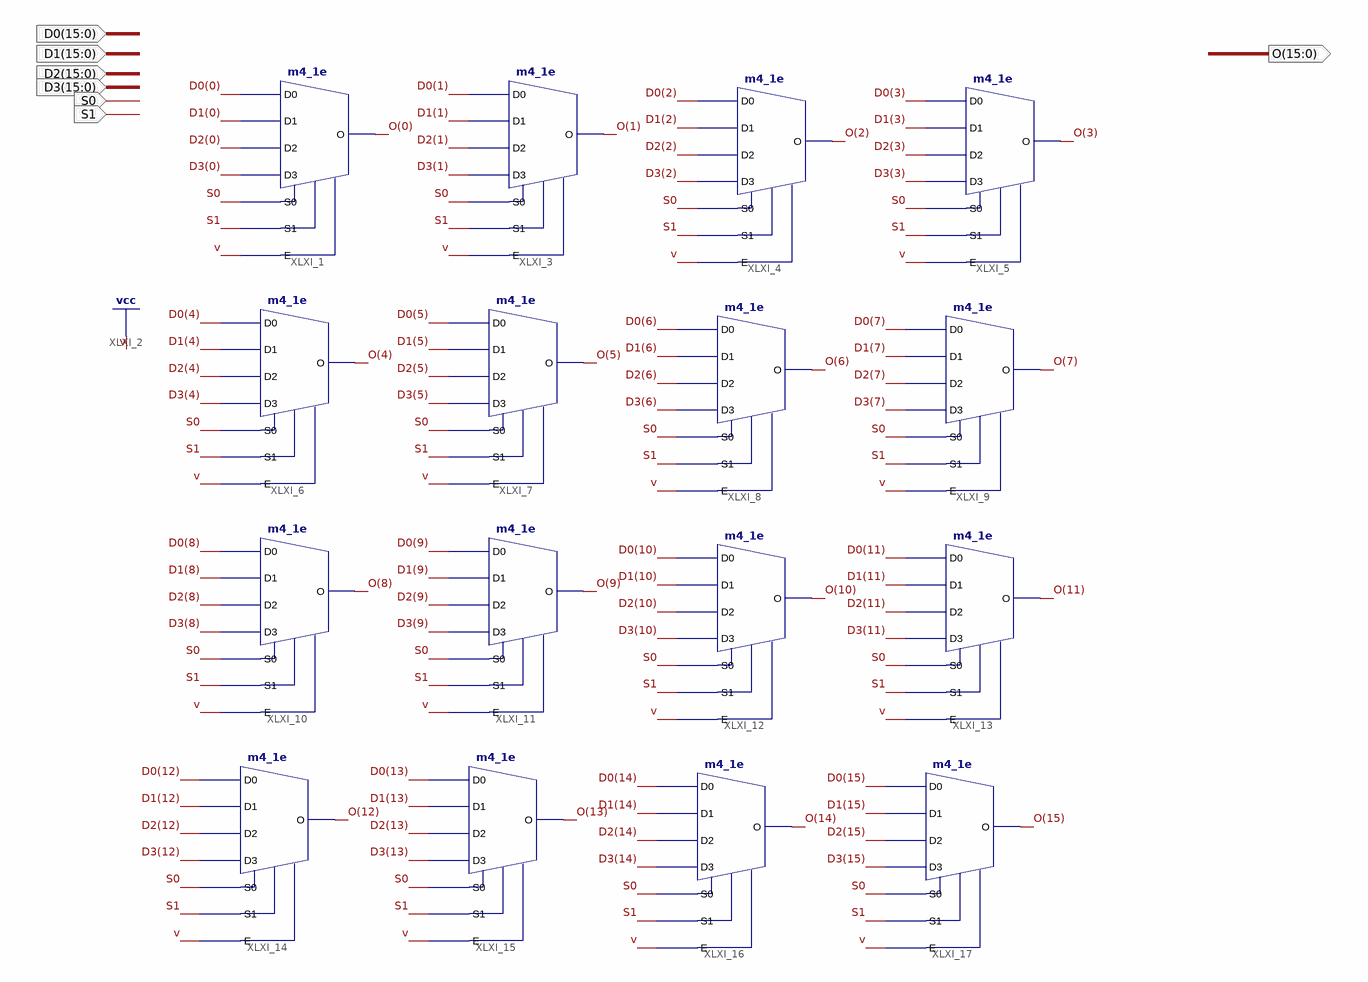
[diagram p0: schematic sheet 1]
// Xilinx ISE schematic mux4_1.sch (spartan3e) as structural Verilog: 16 symbols, 7 ports
module mux4_1 (
  input  [15:0] D0,
  input  [15:0] D1,
  input  [15:0] D2,
  input  [15:0] D3,
  input  S0,
  input  S1,
  output [15:0] O
);

  m4_1e XLXI_1 (.D0(D0[0]), .D1(D1[0]), .D2(D2[0]), .D3(D3[0]), .E(1'b1), .S0(S0), .S1(S1), .O(O[0]));
  m4_1e XLXI_3 (.D0(D0[1]), .D1(D1[1]), .D2(D2[1]), .D3(D3[1]), .E(1'b1), .S0(S0), .S1(S1), .O(O[1]));
  m4_1e XLXI_4 (.D0(D0[2]), .D1(D1[2]), .D2(D2[2]), .D3(D3[2]), .E(1'b1), .S0(S0), .S1(S1), .O(O[2]));
  m4_1e XLXI_5 (.D0(D0[3]), .D1(D1[3]), .D2(D2[3]), .D3(D3[3]), .E(1'b1), .S0(S0), .S1(S1), .O(O[3]));
  m4_1e XLXI_6 (.D0(D0[4]), .D1(D1[4]), .D2(D2[4]), .D3(D3[4]), .E(1'b1), .S0(S0), .S1(S1), .O(O[4]));
  m4_1e XLXI_7 (.D0(D0[5]), .D1(D1[5]), .D2(D2[5]), .D3(D3[5]), .E(1'b1), .S0(S0), .S1(S1), .O(O[5]));
  m4_1e XLXI_8 (.D0(D0[6]), .D1(D1[6]), .D2(D2[6]), .D3(D3[6]), .E(1'b1), .S0(S0), .S1(S1), .O(O[6]));
  m4_1e XLXI_9 (.D0(D0[7]), .D1(D1[7]), .D2(D2[7]), .D3(D3[7]), .E(1'b1), .S0(S0), .S1(S1), .O(O[7]));
  m4_1e XLXI_10 (.D0(D0[8]), .D1(D1[8]), .D2(D2[8]), .D3(D3[8]), .E(1'b1), .S0(S0), .S1(S1), .O(O[8]));
  m4_1e XLXI_11 (.D0(D0[9]), .D1(D1[9]), .D2(D2[9]), .D3(D3[9]), .E(1'b1), .S0(S0), .S1(S1), .O(O[9]));
  m4_1e XLXI_12 (.D0(D0[10]), .D1(D1[10]), .D2(D2[10]), .D3(D3[10]), .E(1'b1), .S0(S0), .S1(S1), .O(O[10]));
  m4_1e XLXI_13 (.D0(D0[11]), .D1(D1[11]), .D2(D2[11]), .D3(D3[11]), .E(1'b1), .S0(S0), .S1(S1), .O(O[11]));
  m4_1e XLXI_14 (.D0(D0[12]), .D1(D1[12]), .D2(D2[12]), .D3(D3[12]), .E(1'b1), .S0(S0), .S1(S1), .O(O[12]));
  m4_1e XLXI_15 (.D0(D0[13]), .D1(D1[13]), .D2(D2[13]), .D3(D3[13]), .E(1'b1), .S0(S0), .S1(S1), .O(O[13]));
  m4_1e XLXI_16 (.D0(D0[14]), .D1(D1[14]), .D2(D2[14]), .D3(D3[14]), .E(1'b1), .S0(S0), .S1(S1), .O(O[14]));
  m4_1e XLXI_17 (.D0(D0[15]), .D1(D1[15]), .D2(D2[15]), .D3(D3[15]), .E(1'b1), .S0(S0), .S1(S1), .O(O[15]));
endmodule
